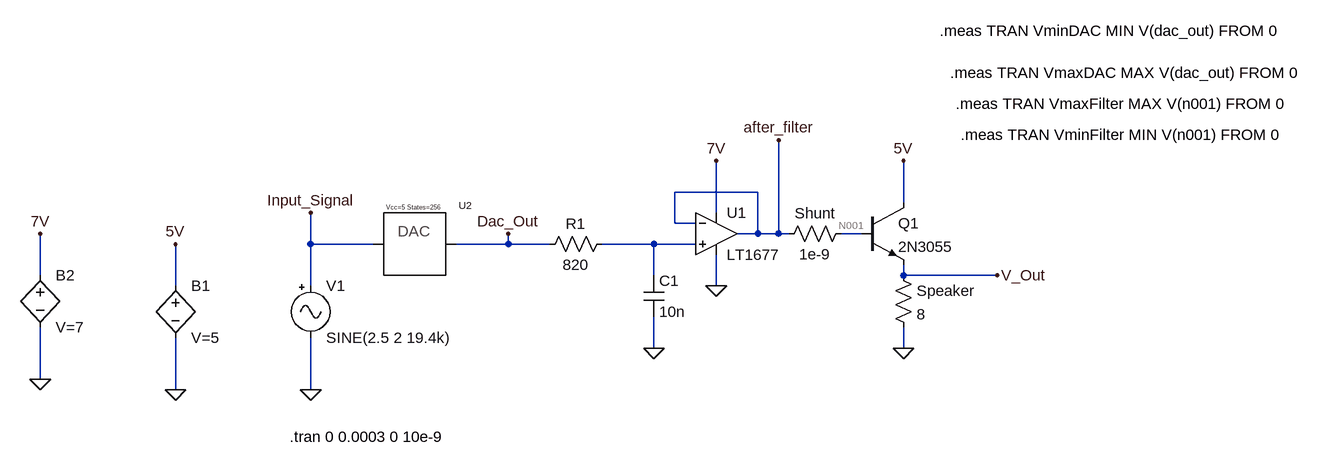
[diagram p0: schematic Speaker_Amp.asc]
Speaker_Amp.asc, the LTspice schematic file:
Version 4
SHEET 1 1696 680
WIRE 672 112 544 112
WIRE 896 128 896 64
WIRE 608 144 608 64
WIRE 544 160 544 112
WIRE 576 160 544 160
WIRE 672 176 672 112
WIRE 672 176 640 176
WIRE 704 176 704 32
WIRE 704 176 672 176
WIRE 720 176 704 176
WIRE 832 176 800 176
WIRE -16 192 -16 144
WIRE 80 192 -16 192
WIRE 288 192 288 176
WIRE 288 192 208 192
WIRE 352 192 288 192
WIRE 512 192 432 192
WIRE 576 192 512 192
WIRE -432 240 -432 176
WIRE 512 240 512 192
WIRE 896 240 896 224
WIRE 1040 240 896 240
WIRE -224 256 -224 192
WIRE -16 256 -16 192
WIRE 608 256 608 208
WIRE 512 352 512 304
WIRE 896 352 896 320
WIRE -432 400 -432 320
WIRE -224 416 -224 336
WIRE -16 416 -16 336
FLAG -16 416 0
FLAG 288 176 Dac_Out
FLAG 896 352 0
FLAG -224 192 5V
FLAG -224 416 0
FLAG 512 352 0
FLAG 608 64 7V
FLAG 608 256 0
FLAG 896 64 5V
FLAG -16 144 Input_Signal
FLAG 1040 240 V_Out
FLAG -432 176 7V
FLAG -432 400 0
FLAG 704 32 after_filter
SYMBOL Misc\\signal -16 240 R0
WINDOW 123 0 0 Left 0
WINDOW 39 0 0 Left 0
SYMATTR InstName V1
SYMATTR Value SINE(2.5 2 19.4k)
SYMBOL npn 832 128 R0
SYMATTR InstName Q1
SYMATTR Value 2N3055
SYMBOL res 880 224 R0
SYMATTR InstName Speaker
SYMATTR Value 8
SYMBOL bv -224 240 R0
SYMATTR InstName B1
SYMATTR Value V=5
SYMBOL custom\\MCP4801 144 192 R0
SYMATTR InstName U2
SYMBOL OpAmps\\LT1677 608 112 R0
SYMATTR InstName U1
SYMBOL res 448 176 R90
WINDOW 0 0 56 VBottom 2
WINDOW 3 32 56 VTop 2
SYMATTR InstName R1
SYMATTR Value 820
SYMBOL cap 496 240 R0
SYMATTR InstName C1
SYMATTR Value 10n
SYMBOL res 816 160 R90
WINDOW 0 0 56 VBottom 2
WINDOW 3 32 56 VTop 2
SYMATTR InstName Shunt
SYMATTR Value 1e-9
SYMBOL bv -432 224 R0
SYMATTR InstName B2
SYMATTR Value V=7
TEXT -48 488 Left 2 !.tran 0 0.0003 0 10e-9
TEXT 968 -72 Left 2 !.meas TRAN VmaxDAC MAX V(dac_out) FROM 0
TEXT 976 -24 Left 2 !.meas TRAN VmaxFilter MAX V(n001) FROM 0
TEXT 984 24 Left 2 !.meas TRAN VminFilter MIN V(n001) FROM 0
TEXT 952 -136 Left 2 !.meas TRAN VminDAC MIN V(dac_out) FROM 0

The netlist it stands for:
* Speaker_Amp.asc
V1 Input_Signal 0 SINE(2.5 2 19.4k)
Q1 5V N001 V_Out 0 2N3055
R§Speaker V_Out 0 8
B1 5V 0 V=5
XU2 Input_Signal Dac_Out MCP4801 Ri= 10e6 Vcc=5 States=256  ; pins In Out
XU1 N002 after_filter 7V 0 after_filter LT1677  ; pins In+ In- V+ V- OUT
R1 N002 Dac_Out 820
C1 N002 0 10n
R§Shunt N001 after_filter 1e-9
B2 7V 0 V=7
.model NPN NPN
.model PNP PNP
.lib standard.bjt
.tran 0 0.0003 0 10e-9
.meas TRAN VmaxDAC MAX V(dac_out) FROM 0
.meas TRAN VmaxFilter MAX V(n001) FROM 0
.meas TRAN VminFilter MIN V(n001) FROM 0
.meas TRAN VminDAC MIN V(dac_out) FROM 0
.lib MCP4801.sub
.lib LTC.lib
.backanno
.end